# Altium project LNA_1.7GHz_main.PrjPcb
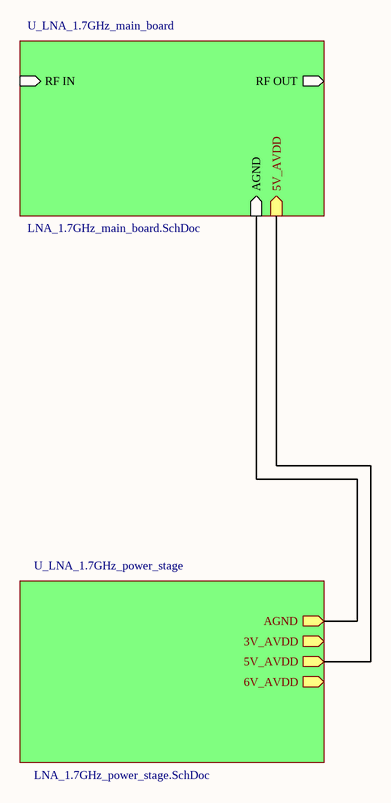
[diagram p0: LNA_1.7GHz_main_symbol.SchDoc]
3 sheets, 117 parts. Net scope: hierarchical (ports join the sheet entries above them; power ports are global).
Board file: LNA_1.7GHz_main_board.PcbDoc
Sheets:
  LNA_1.7GHz_main_symbol.SchDoc
    U_LNA_1.7GHz_main_board = LNA_1.7GHz_main_board.SchDoc
    U_LNA_1.7GHz_power_stage = LNA_1.7GHz_power_stage.SchDoc

## Sheet LNA_1.7GHz_main_symbol.SchDoc: {Наименование}
size 420 x 297 mm; ApprovedBy: {Утвердил}; CheckedBy: {Проверил}; DrawnBy: {Разраб.}; DocumentNumber: АБВГ 123456.789 00; SheetNumber: 1; SheetTotal: 3; Scale: {Мш.}; PageSetup: Record=PageOptions|CenterHorizontal=False|CenterVertical=False|PrintScale=0.95|XCorrection=0.00|YCorrection=0.00|PrintKind=1|BorderSize=5000000|LeftOffset=0|BottomOffset=0|Orientation=1|PaperLength=1000|PaperWidth=1000|Scale=100|PaperSource=15|PrintQuality=600|MediaType=1|DitherType=10|PaperKind=A4|PrintScaleMode=1; ProcessInspection: {Т.контр.}; Mass: {М.}; NormInspection: {Н.контр.}; Letter1Column: {}; Letter2Column: {}; Letter3Column: {}; DocumentType: {Документ}; Rule: PcbType=ProtelPcb

### Sub-sheets
U_LNA_1.7GHz_main_board = LNA_1.7GHz_main_board.SchDoc: RF IN (in), AGND (in), RF OUT (out), 5V_AVDD (in)
U_LNA_1.7GHz_power_stage = LNA_1.7GHz_power_stage.SchDoc: AGND (out), 3V_AVDD (out), 6V_AVDD (out), 5V_AVDD (out)

### Nets
5V_AVDD: sheet U_LNA_1.7GHz_main_board/5V_AVDD, sheet U_LNA_1.7GHz_power_stage/5V_AVDD
AGND: sheet U_LNA_1.7GHz_main_board/AGND, sheet U_LNA_1.7GHz_power_stage/AGND

### Notes on the sheet
- Перв. примен.
- Справ. №
- Подп. и дата
- Инв. № дубл.
- Взам. инв. №
- Изм.
- Лист
- № докум.
- Подп.
- Дата
- Лит.
- Масса
- Масштаб
- Т.контр.
- Пров.
- Разраб.
- Листов
- Инв. № подл.
- Н.контр.
- Утв.
- Копировал
- Формат А3

## Sheet LNA_1.7GHz_main_board.SchDoc: {Наименование}
size 420 x 297 mm; ApprovedBy: {Утвердил}; CheckedBy: {Проверил}; DrawnBy: {Разраб.}; DocumentNumber: АБВГ 123456.789 00; SheetNumber: 2; SheetTotal: 3; Scale: {Мш.}; PageSetup: Record=PageOptions|CenterHorizontal=False|CenterVertical=False|PrintScale=0.95|XCorrection=0.00|YCorrection=0.00|PrintKind=1|BorderSize=5000000|LeftOffset=0|BottomOffset=0|Orientation=1|PaperLength=1000|PaperWidth=1000|Scale=100|PaperSource=15|PrintQuality=600|MediaType=1|DitherType=10|PaperKind=A4|PrintScaleMode=1; ProcessInspection: {Т.контр.}; Mass: {М.}; NormInspection: {Н.контр.}; Letter1Column: {}; Letter2Column: {}; Letter3Column: {}; DocumentType: {Документ}; Rule: PcbType=ProtelPcb
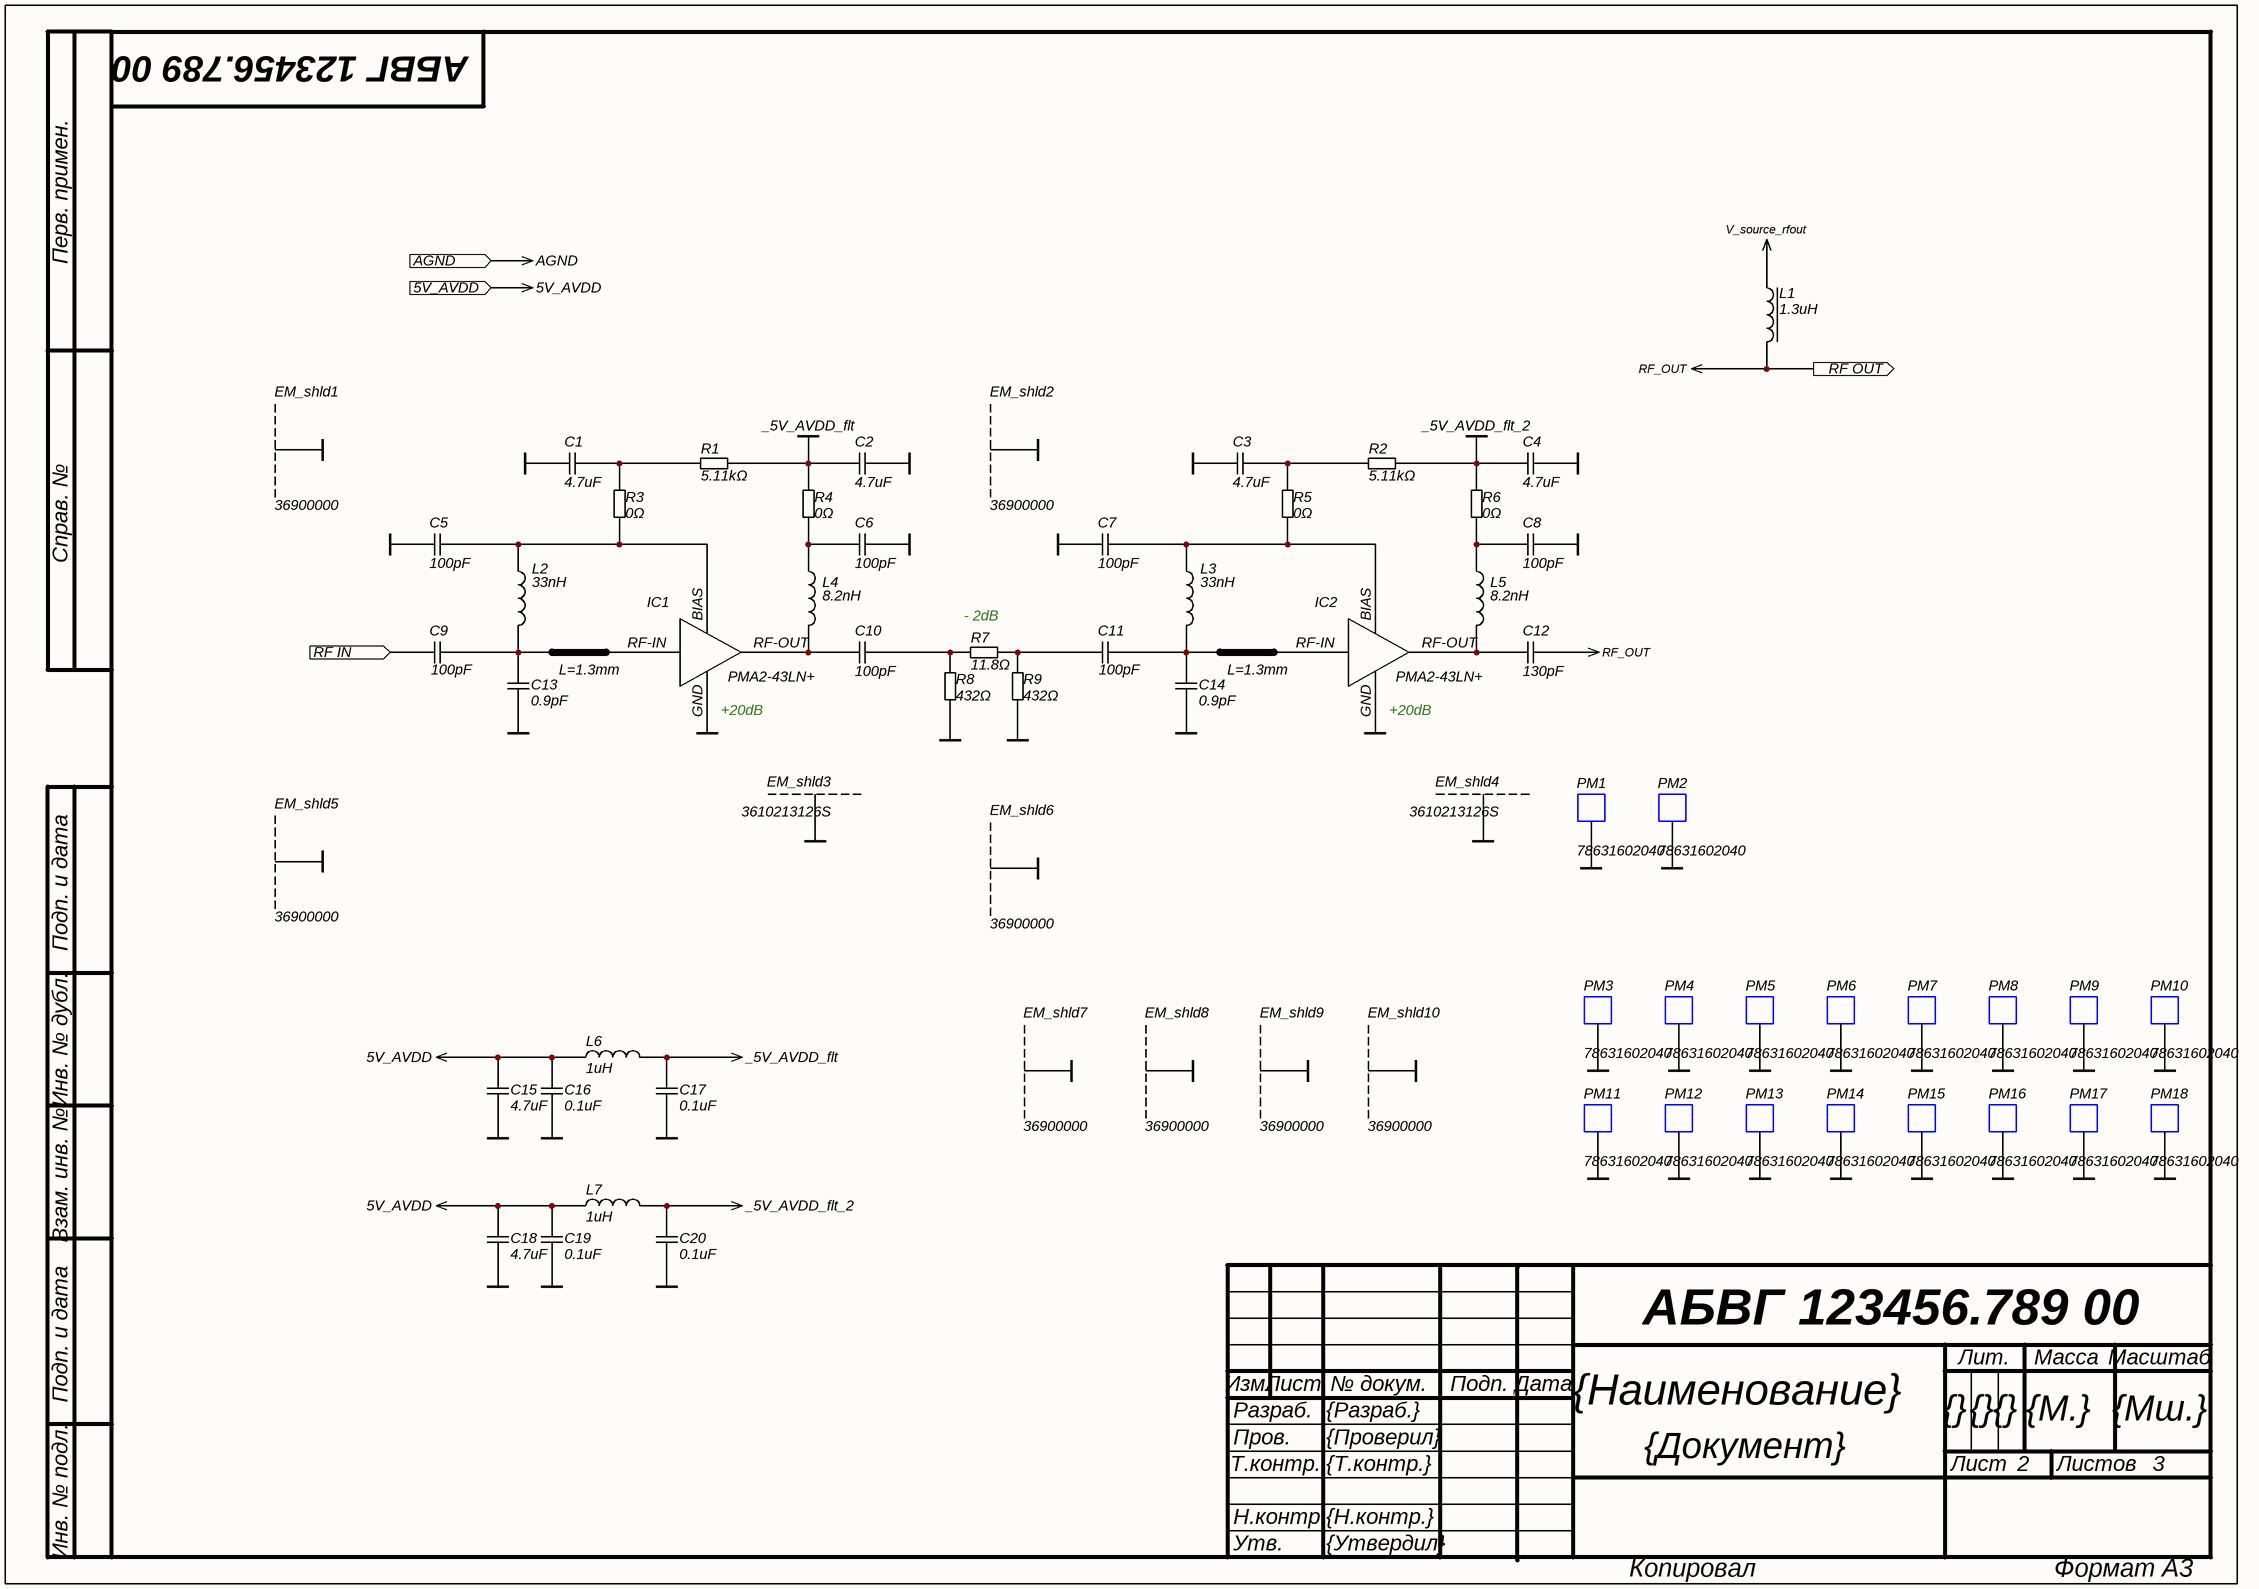
[diagram p1: LNA_1.7GHz_main_board.SchDoc]

### Parts
C1  4.7uF  [C0603]
C2  4.7uF  [C0603]
C3  4.7uF  [C0603]
C4  4.7uF  [C0603]
C5  100pF  [C0603]
C6  100pF  [C0603]
C7  100pF  [C0603]
C8  100pF  [C0603]
C9  100pF  [C0603]
C10  100pF  [C0603]
C11  100pF  [C0603]
C12  130pF  [C0603]
C13  0.9pF  [C0603]
C14  0.9pF  [C0603]
C15  4.7uF  [C0603]
C16  0.1uF  [C0603]
C17  0.1uF  [C0603]
C18  4.7uF  [C0603]
C19  0.1uF  [C0603]
C20  0.1uF  [C0603]
EM_shld1  36900000  [36900000]
EM_shld2  36900000  [36900000]
EM_shld3  3610213126S  [3610213126S]
EM_shld4  3610213126S  [3610213126S]
EM_shld5  36900000  [36900000]
EM_shld6  36900000  [36900000]
EM_shld7  36900000  [36900000]
EM_shld8  36900000  [36900000]
EM_shld9  36900000  [36900000]
EM_shld10  36900000  [36900000]
IC1  PMA2-43LN+  [MC1631-1_MNC-L]
IC2  PMA2-43LN+  [MC1631-1_MNC-L]
L1  1.3uH  [4310LC]
L2  33nH  [L0603_HP]
L3  33nH  [L0603_HP]
L4  8.2nH  [L0603_HP]
L5  8.2nH  [L0603_HP]
L6  1uH  [L1206_Murata]
L7  1uH  [L1206_Murata]
PM1  78631602040  [78631602040]
PM2  78631602040  [78631602040]
PM3  78631602040  [78631602040]
PM4  78631602040  [78631602040]
PM5  78631602040  [78631602040]
PM6  78631602040  [78631602040]
PM7  78631602040  [78631602040]
PM8  78631602040  [78631602040]
PM9  78631602040  [78631602040]
PM10  78631602040  [78631602040]
PM11  78631602040  [78631602040]
PM12  78631602040  [78631602040]
PM13  78631602040  [78631602040]
PM14  78631602040  [78631602040]
PM15  78631602040  [78631602040]
PM16  78631602040  [78631602040]
PM17  78631602040  [78631602040]
PM18  78631602040  [78631602040]
R1  5.11kΩ  [R0603]
R2  5.11kΩ  [R0603]
R3  0Ω  [R0603]
R4  0Ω  [R0603]
R5  0Ω  [R0603]
R6  0Ω  [R0603]
R7  11.8Ω  [R0603]
R8  432Ω  [R0603]
R9  432Ω  [R0603]

### Ports
5V_AVDD (in), AGND (in), RF IN (in), RF OUT (out)

### Nets
5V_AVDD: C15.2 C16.2 C18.2 C19.2 L6.2 L7.2 ; port 5V_AVDD
_5V_AVDD_flt: C2.1 C17.2 L6.1 R1.1 R4.2
_5V_AVDD_flt_2: C4.1 C20.2 L7.1 R2.1 R6.2
AGND: C1.1 C2.2 C3.1 C4.2 C5.1 C6.2 C7.1 C8.2 C13.1 C14.1 C15.1 C16.1 C17.1 C18.1 C19.1 C20.1 EM_shld1.1 EM_shld2.1 EM_shld3.1 EM_shld4.1 EM_shld5.1 EM_shld6.1 EM_shld7.1 EM_shld8.1 EM_shld9.1 EM_shld10.1 IC1.GND IC2.GND PM1.1 PM2.1 PM3.1 PM4.1 PM5.1 PM6.1 PM7.1 PM8.1 PM9.1 PM10.1 PM11.1 PM12.1 PM13.1 PM14.1 PM15.1 PM16.1 PM17.1 PM18.1 R8.2 R9.2 ; port AGND
RF_OUT: C12.1 L1.1 ; port RF OUT
V_source_rfout: L1.2
NetC1_2: C1.2 R1.2 R3.2
NetC3_2: C3.2 R2.2 R5.2
NetC5_2: C5.2 IC1.BIAS L2.1 R3.1
NetC6_1: C6.1 L4.1 R4.1
NetC7_2: C7.2 IC2.BIAS L3.1 R5.1
NetC8_1: C8.1 L5.1 R6.1
NetC9_1: C9.1 ; port RF IN
NetC9_2: C9.2 C13.2 IC1.RF-IN L2.2
NetC10_1: C10.1 IC1.RF-OUT L4.2
NetC10_2: C10.2 R7.2 R8.1
NetC11_1: C11.1 R7.1 R9.1
NetC11_2: C11.2 C14.2 IC2.RF-IN L3.2
NetC12_2: C12.2 IC2.RF-OUT L5.2

### Notes on the sheet
- (near R7) - 2dB
- L=1.3mm
- (near IC1) +20dB
- (near IC2) +20dB
- Перв. примен.
- Справ. №
- Подп. и дата
- Инв. № дубл.
- Взам. инв. №
- Изм.
- Лист
- № докум.
- Подп.
- Дата
- Лит.
- Масса
- Масштаб
- Т.контр.
- Пров.
- Разраб.
- Листов
- Инв. № подл.
- Н.контр.
- Утв.
- Копировал
- Формат А3

### Library data of the parts
C1-C11 C13-C20 = CAP: Керамический конденсатор; Корпус: 0603 [1608 Метрический]; Диэлектрик: X5R; Напряжение: 16B; Вид монтажа: SMD; Температурный диапазон: -55 ~ 100; Тип элемента: Керамический конденсатор
  C1-C4 C15 C18: Номинал: 4.7uF
  C5-C11: Номинал: 100pF
  C13 C14: Номинал: 0.9pF
  C16 C17 C19 C20: Номинал: 0.1uF
C12 = CAP: Керамический конденсатор; Корпус: 0603 (1608 Metric); Диэлектрик: X7R; Напряжение: 50B; Вид монтажа: SMD; Температурный диапазон: -55 ~ 100; Номинал: 130pF; Тип элемента: Керамический конденсатор
EM_shld1 EM_shld2 EM_shld5-EM_shld10 = RF Shield: RF Shield Frame X 0.522" (13.26mm) Surface Mount; Производитель: Wurth Elektronik; Вид монтажа: SMD/SMT; Тип элемента: EMI/RFI Shield, One-Piece; Название: 36900000; Артикул: 36900000
EM_shld3 EM_shld4 = RF Shield: RF Shield Frame X 0.522" (13.26mm) Surface Mount; Производитель: Wurth Elektronik; Вид монтажа: SMD/SMT; Тип элемента: EMI/RFI Shield, One-Piece; Примечание: Mate with 3600213120S (Two pieces shield); Артикул: 3610213126S; Корпус: 0.522" (13.26mm)
IC1 IC2 = PMA2-43LN+: Малошумяший усилитель; Производитель: Mini-Circuits; Вид монтажа: SMD; Тип элемента: Микросхема; Температурный диапазон: -40 ~ 100; Название: PMA2-43LN+; Артикул: PMA2-43LN+
L1 = 4310LC: Индуктивность; Производитель: Coilcraft; Вид монтажа: SMD; Тип элемента: Катушка индуктивности; Температурный диапазон: -40ºC to 125ºC; Примечание: 3A; Название: 4310lc; Артикул: 4310lc; Номинал: 1.3uH
L2-L5 = Inducror RF: Индуктивность; Производитель: Coilcraft; Корпус: 0603 [1608 Метрический]; Вид монтажа: SMD; Тип элемента: Катушка индуктивности; Температурный диапазон: -40ºC to 125ºC
  L2 L3: Номинал: 33nH
  L4 L5: Номинал: 8.2nH
L6 L7 = Inducror LF: Индуктивность; Производитель: Murata; Корпус: 1206 [3216 Metric]; Вид монтажа: SMD; Тип элемента: Катушка индуктивности; Температурный диапазон: -40ºC to 125ºC; Номинал: 1uH
PM1-PM18 = 78631602040: WE-SCFA Soldered Contact Finger Automotive, L6W2H4mm, Working Height 5~5.7mm; Производитель: Wurth Elektronik; Вид монтажа: SMD/SMT; Артикул: 78631602040
R1-R9 = RES: SMD резистор; Производитель: 1%; Корпус: 0603 [1608 Метрический]; Точность: 1%; Название: Резистор; Вид монтажа: SMD; Тип элемента: Резистор
  R1 R2: Номинал: 5.11kΩ
  R3-R6: Номинал: 0Ω
  R7: Номинал: 11.8Ω
  R8 R9: Номинал: 432Ω

## Sheet LNA_1.7GHz_power_stage.SchDoc: {Наименование}
size 420 x 297 mm; ApprovedBy: {Утвердил}; CheckedBy: {Проверил}; DrawnBy: {Разраб.}; DocumentNumber: АБВГ 123456.789 00; SheetNumber: 3; SheetTotal: 3; Scale: {Мш.}; PageSetup: Record=PageOptions|CenterHorizontal=False|CenterVertical=False|PrintScale=0.95|XCorrection=0.00|YCorrection=0.00|PrintKind=1|BorderSize=5000000|LeftOffset=0|BottomOffset=0|Orientation=1|PaperLength=1000|PaperWidth=1000|Scale=100|PaperSource=15|PrintQuality=600|MediaType=1|DitherType=10|PaperKind=A4|PrintScaleMode=1; ProcessInspection: {Т.контр.}; Mass: {М.}; NormInspection: {Н.контр.}; Letter1Column: {}; Letter2Column: {}; Letter3Column: {}; DocumentType: {Документ}; Rule: PcbType=ProtelPcb
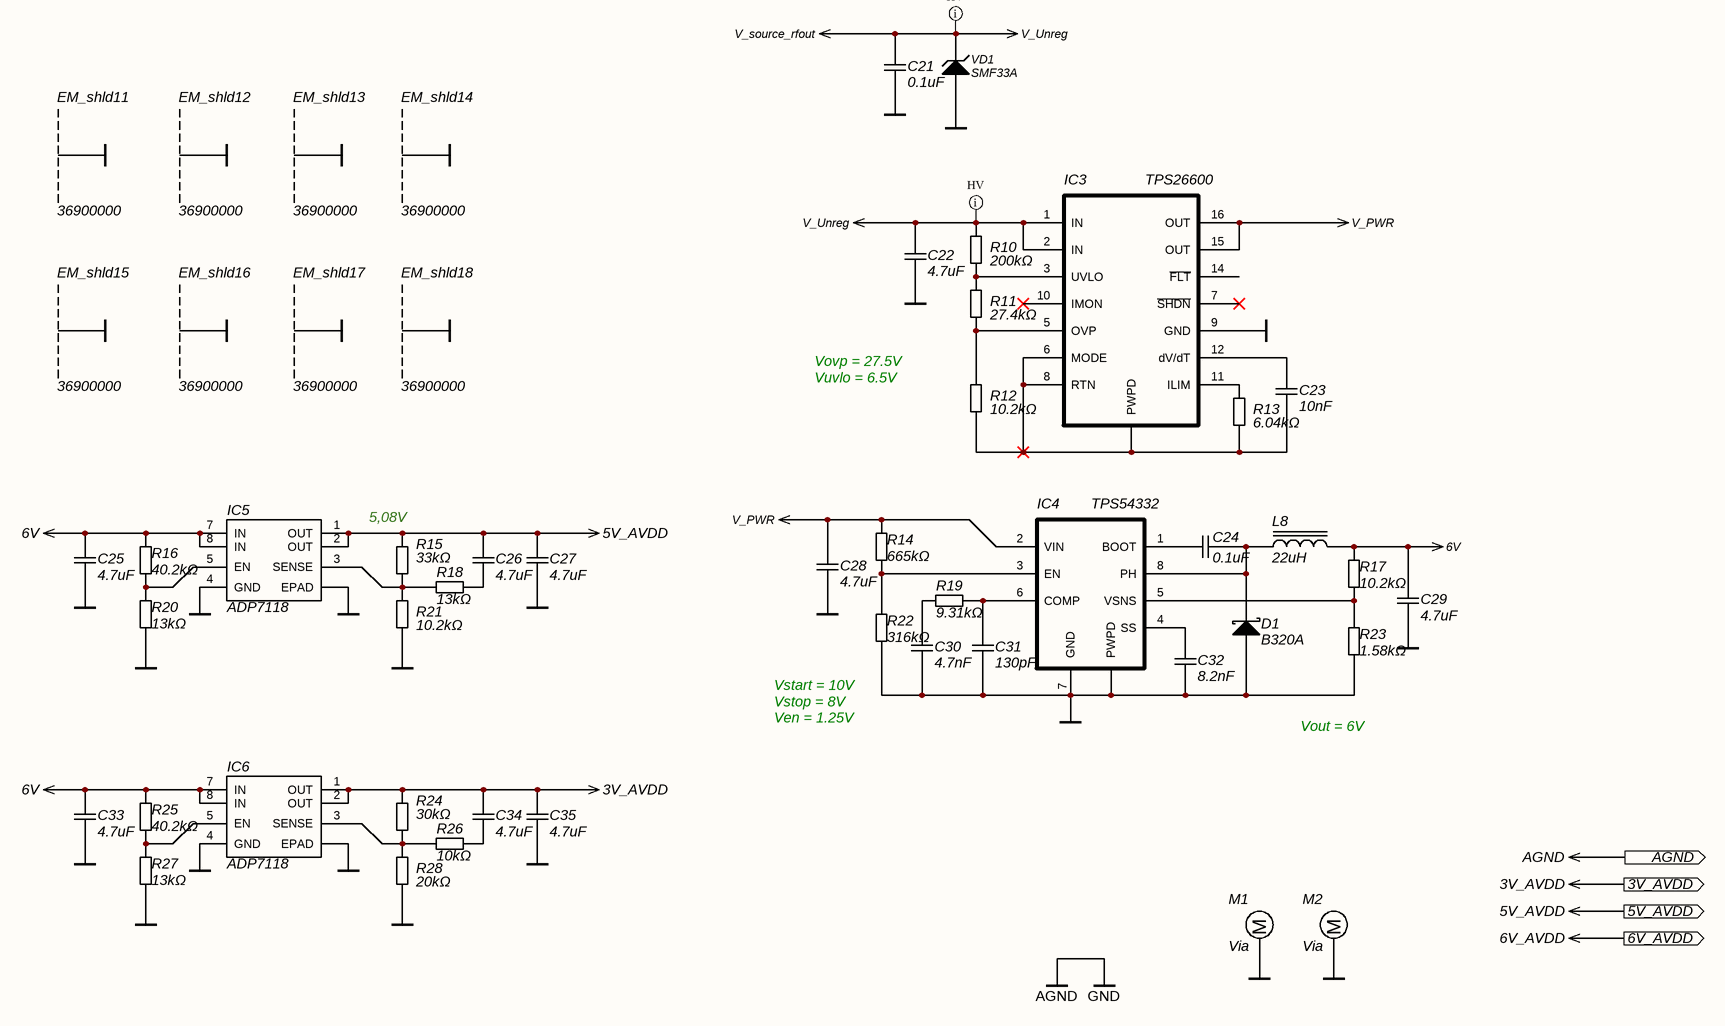
[diagram p2: LNA_1.7GHz_power_stage.SchDoc]

### Parts
C21  0.1uF  [C0603]
C22  4.7uF  [C0805]
C23  10nF  [C0603]
C24  0.1uF  [C0603]
C25  4.7uF  [C0603]
C26  4.7uF  [C0603]
C27  4.7uF  [C0603]
C28  4.7uF  [C0805]
C29  4.7uF  [C0805]
C30  4.7nF  [C0603]
C31  130pF  [C0603]
C32  8.2nF  [C0603]
C33  4.7uF  [C0603]
C34  4.7uF  [C0603]
C35  4.7uF  [C0603]
D1  B320A  [Diode_SMA]
EM_shld11  36900000  [36900000]
EM_shld12  36900000  [36900000]
EM_shld13  36900000  [36900000]
EM_shld14  36900000  [36900000]
EM_shld15  36900000  [36900000]
EM_shld16  36900000  [36900000]
EM_shld17  36900000  [36900000]
EM_shld18  36900000  [36900000]
IC3  TPS26600  [R-PDSO-G16]
IC4  TPS54332  [R-PDSO-G8]
IC5  ADP7118  [SOIC_N_EP]
IC6  ADP7118  [SOIC_N_EP]
L8  22uH  [XAL6060-223]
M1  Via  [Mechanical_Via]
M2  Via  [Mechanical_Via]
R10  200kΩ  [R0603]
R11  27.4kΩ  [R0603]
R12  10.2kΩ  [R0603]
R13  6.04kΩ  [R0603]
R14  665kΩ  [R0603]
R15  33kΩ  [R0603]
R16  40.2kΩ  [R0603]
R17  10.2kΩ  [R0603]
R18  13kΩ  [R0603]
R19  9.31kΩ  [R0603]
R20  13kΩ  [R0603]
R21  10.2kΩ  [R0603]
R22  316kΩ  [R0603]
R23  1.58kΩ  [R0603]
R24  30kΩ  [R0603]
R25  40.2kΩ  [R0603]
R26  10kΩ  [R0603]
R27  13kΩ  [R0603]
R28  20kΩ  [R0603]
VD1  SMF33A  [SOD-123F]

### Ports
3V_AVDD (out), 5V_AVDD (out), 6V_AVDD (out), AGND (out)

### Nets
3V_AVDD: C34.2 C35.2 IC6.1(OUT) IC6.2(OUT) R24.2 ; port 3V_AVDD
5V_AVDD: C26.2 C27.2 IC5.1(OUT) IC5.2(OUT) R15.2 ; port 5V_AVDD
6V: C25.2 C29.2 C33.2 IC5.7(IN) IC5.8(IN) IC6.7(IN) IC6.8(IN) L8.1 R16.2 R17.2 R25.2
6V_AVDD: port 6V_AVDD
AGND: C21.1 C22.1 C25.1 C27.1 C28.1 C29.1 C30.1 C31.1 C32.1 C33.1 C35.1 D1.2(A) EM_shld11.1 EM_shld12.1 EM_shld13.1 EM_shld14.1 EM_shld15.1 EM_shld16.1 EM_shld17.1 EM_shld18.1 IC3.9(GND) IC4.7(GND) IC4.9(PWPD) IC5.4(GND) IC5.9(EPAD) IC6.4(GND) IC6.9(EPAD) M1.0(M) M2.0(M) R20.1 R21.1 R22.2 R23.1 R27.1 R28.1 VD1.2(A) ; port AGND  [also labelled GND]
V_PWR: C28.2 IC3.15(OUT) IC3.16(OUT) IC4.2(VIN) R14.1
V_source_rfout: C21.2 C22.2 IC3.1(IN) IC3.2(IN) R10.2 VD1.1(K)  [also labelled V_Unreg]
NetC23_1: C23.1 IC3.6(MODE) IC3.8(RTN) IC3.17(PWPD) R12.1 R13.1
NetC23_2: C23.2 IC3.12(dV/dT)
NetC24_1: C24.1 D1.1(K) IC4.8(PH) L8.2
NetC24_2: C24.2 IC4.1(BOOT)
NetC26_1: C26.1 R18.1
NetC30_2: C30.2 R19.1
NetC31_2: C31.2 IC4.6(COMP) R19.2
NetC32_2: C32.2 IC4.4(SS)
NetC34_1: C34.1 R26.1
NetIC3_3: IC3.3(UVLO) R10.1 R11.2
NetIC3_5: IC3.5(OVP) R11.1 R12.2
NetIC3_11: IC3.11(ILIM) R13.2
NetIC4_3: IC4.3(EN) R14.2 R22.1
NetIC4_5: IC4.5(VSNS) R17.1 R23.2
NetIC5_3: IC5.3(SENSE) R15.1 R18.2 R21.2
NetIC5_5: IC5.5(EN) R16.1 R20.2
NetIC6_3: IC6.3(SENSE) R24.1 R26.2 R28.2
NetIC6_5: IC6.5(EN) R25.1 R27.2

Not connected (* = marked no-connect by the designer): IC3 7(~{SHDN})* 10(IMON)* 14(~{FLT})

### Layout directives
net class HV: V_source_rfout

### Notes on the sheet
- Vovp = 27.5V
  Vuvlo = 6.5V
- (near R15) 5,08V
- Vstart = 10V
  Vstop = 8V
  Ven = 1.25V
- Vout = 6V
- Перв. примен.
- Справ. №
- Подп. и дата
- Инв. № дубл.
- Взам. инв. №
- Изм.
- Лист
- № докум.
- Подп.
- Дата
- Т.контр.
- Пров.
- Разраб.
- Лит.
- Листов
- Инв. № подл.
- Н.контр.
- Утв.
- Копировал
- Формат А3

### Library data of the parts
C21 C24 C31 = CAP: as C12 on sheet LNA_1.7GHz_main_board; Тип элемента: Керамический конденсатор
  C21 C24: Номинал: 0.1uF
  C31: Номинал: 130pF
C22 C28 C29 = CAP: Керамический конденсатор; Корпус: 0805 [2012 метрический]; Диэлектрик: X7R; Напряжение: 50B; Вид монтажа: SMD; Температурный диапазон: -55 ~ 100; Номинал: 4.7uF; Тип элемента: Керамический конденсатор
C23 C30 C32 = CAP: Керамический конденсатор; Корпус: 0603 (1608 Metric); Диэлектрик: X7R; Напряжение: 25B; Вид монтажа: SMD; Температурный диапазон: -55 ~ 100; Тип элемента: Керамический конденсатор
  C23: Номинал: 10nF
  C30: Номинал: 4.7nF
  C32: Номинал: 8.2nF
C25-C27 C33-C35 = CAP: Керамический конденсатор; Корпус: 0603 (1608 Metric); Диэлектрик: X5R; Напряжение: 16B; Вид монтажа: SMD; Температурный диапазон: -55 ~ 100; Номинал: 4.7uF; Тип элемента: Керамический конденсатор
D1 = B320A: Диод Шоттки 100В 1А; Номинал: 1A; Напряжение: 20В; Вид монтажа: SMD; Название: B320A; Артикул: B320A; Тип элемента: Диод шоттки
EM_shld11-EM_shld18 = RF Shield: as EM_shld1 on sheet LNA_1.7GHz_main_board; Название: 36900000; Артикул: 36900000
IC3 = TPS26600: Микросхема DC-DC преобразователь; Производитель: TI; Артикул: TPS26600PWPR; Корпус: 16-HTSSOP; Вид монтажа: SMD; Температурный диапазон: −40°C to + 150°C; Название: TPS26600; Тип элемента: Микросхема
IC4 = TPS54332: Микросхема DC-DC преобразователь; Производитель: TI; Корпус: 8-Pin SOIC PowerPAD; Напряжение: 3.5-28 B; Вид монтажа: SMD; Температурный диапазон: −40°C to + 150°C; Примечание: 3А; Название: TPS54332; Тип элемента: Микросхема
IC5 IC6 = ADP7118: Микросхема линейный преобразователь; Производитель: Analog Devices; Корпус: 8-Pin SOIC PowerPAD; Напряжение: 2.7-20 B; Вид монтажа: SMD; Температурный диапазон: −40°C to + 150°C; Примечание: 200mА; Название: ADP7118; Тип элемента: Микросхема
L8 = Inductor PWR: Индуктивность; Производитель: Coilcraft; Вид монтажа: SMD; Тип элемента: Катушка индуктивности; Температурный диапазон: -40ºC to 125ºC; Примечание: 2.5A; Название: XAL6060-223; Артикул: XAL6060-223; Номинал: 22uH
M1 M2 = Mechanical Via
R10-R28 = RES: SMD резистор; Корпус: 0603 (1608 Metric); Точность: 1%; Название: Резистор; Вид монтажа: SMD; Тип элемента: Резистор
  R10: Номинал: 200kΩ
  R11: Номинал: 27.4kΩ
  R12 R17 R21: Номинал: 10.2kΩ
  R13: Номинал: 6.04kΩ
  R14: Номинал: 665kΩ
  R15: Номинал: 33kΩ
  R16 R25: Номинал: 40.2kΩ
  R18 R20 R27: Номинал: 13kΩ
  R19: Номинал: 9.31kΩ
  R22: Номинал: 316kΩ
  R23: Номинал: 1.58kΩ
  R24: Номинал: 30kΩ
  R26: Номинал: 10kΩ
  R28: Номинал: 20kΩ
VD1 = TVS: TVS Diode; Manufacturer: Littelfuse; Power: 200W; Voltage: 33V; Name: SMF33A; Package: SOD-123F

## Nets that join several sheets
5V_AVDD: LNA_1.7GHz_main_board (6 pins), LNA_1.7GHz_power_stage (5 pins)
AGND: LNA_1.7GHz_main_board (48 pins), LNA_1.7GHz_power_stage (36 pins)
V_source_rfout: LNA_1.7GHz_main_board (L1.2), LNA_1.7GHz_power_stage (6 pins)